# Altium schematic sheet HVP_PowerSupply_v1.0.SchDoc
size A3; Organization: SEW EURODRIVE; Address1: Jose Rubim Rd.; Address2: Santos Dumont Rd.; Address3: 205; Address4: Indaiatuba/SP; Address5: Brazil
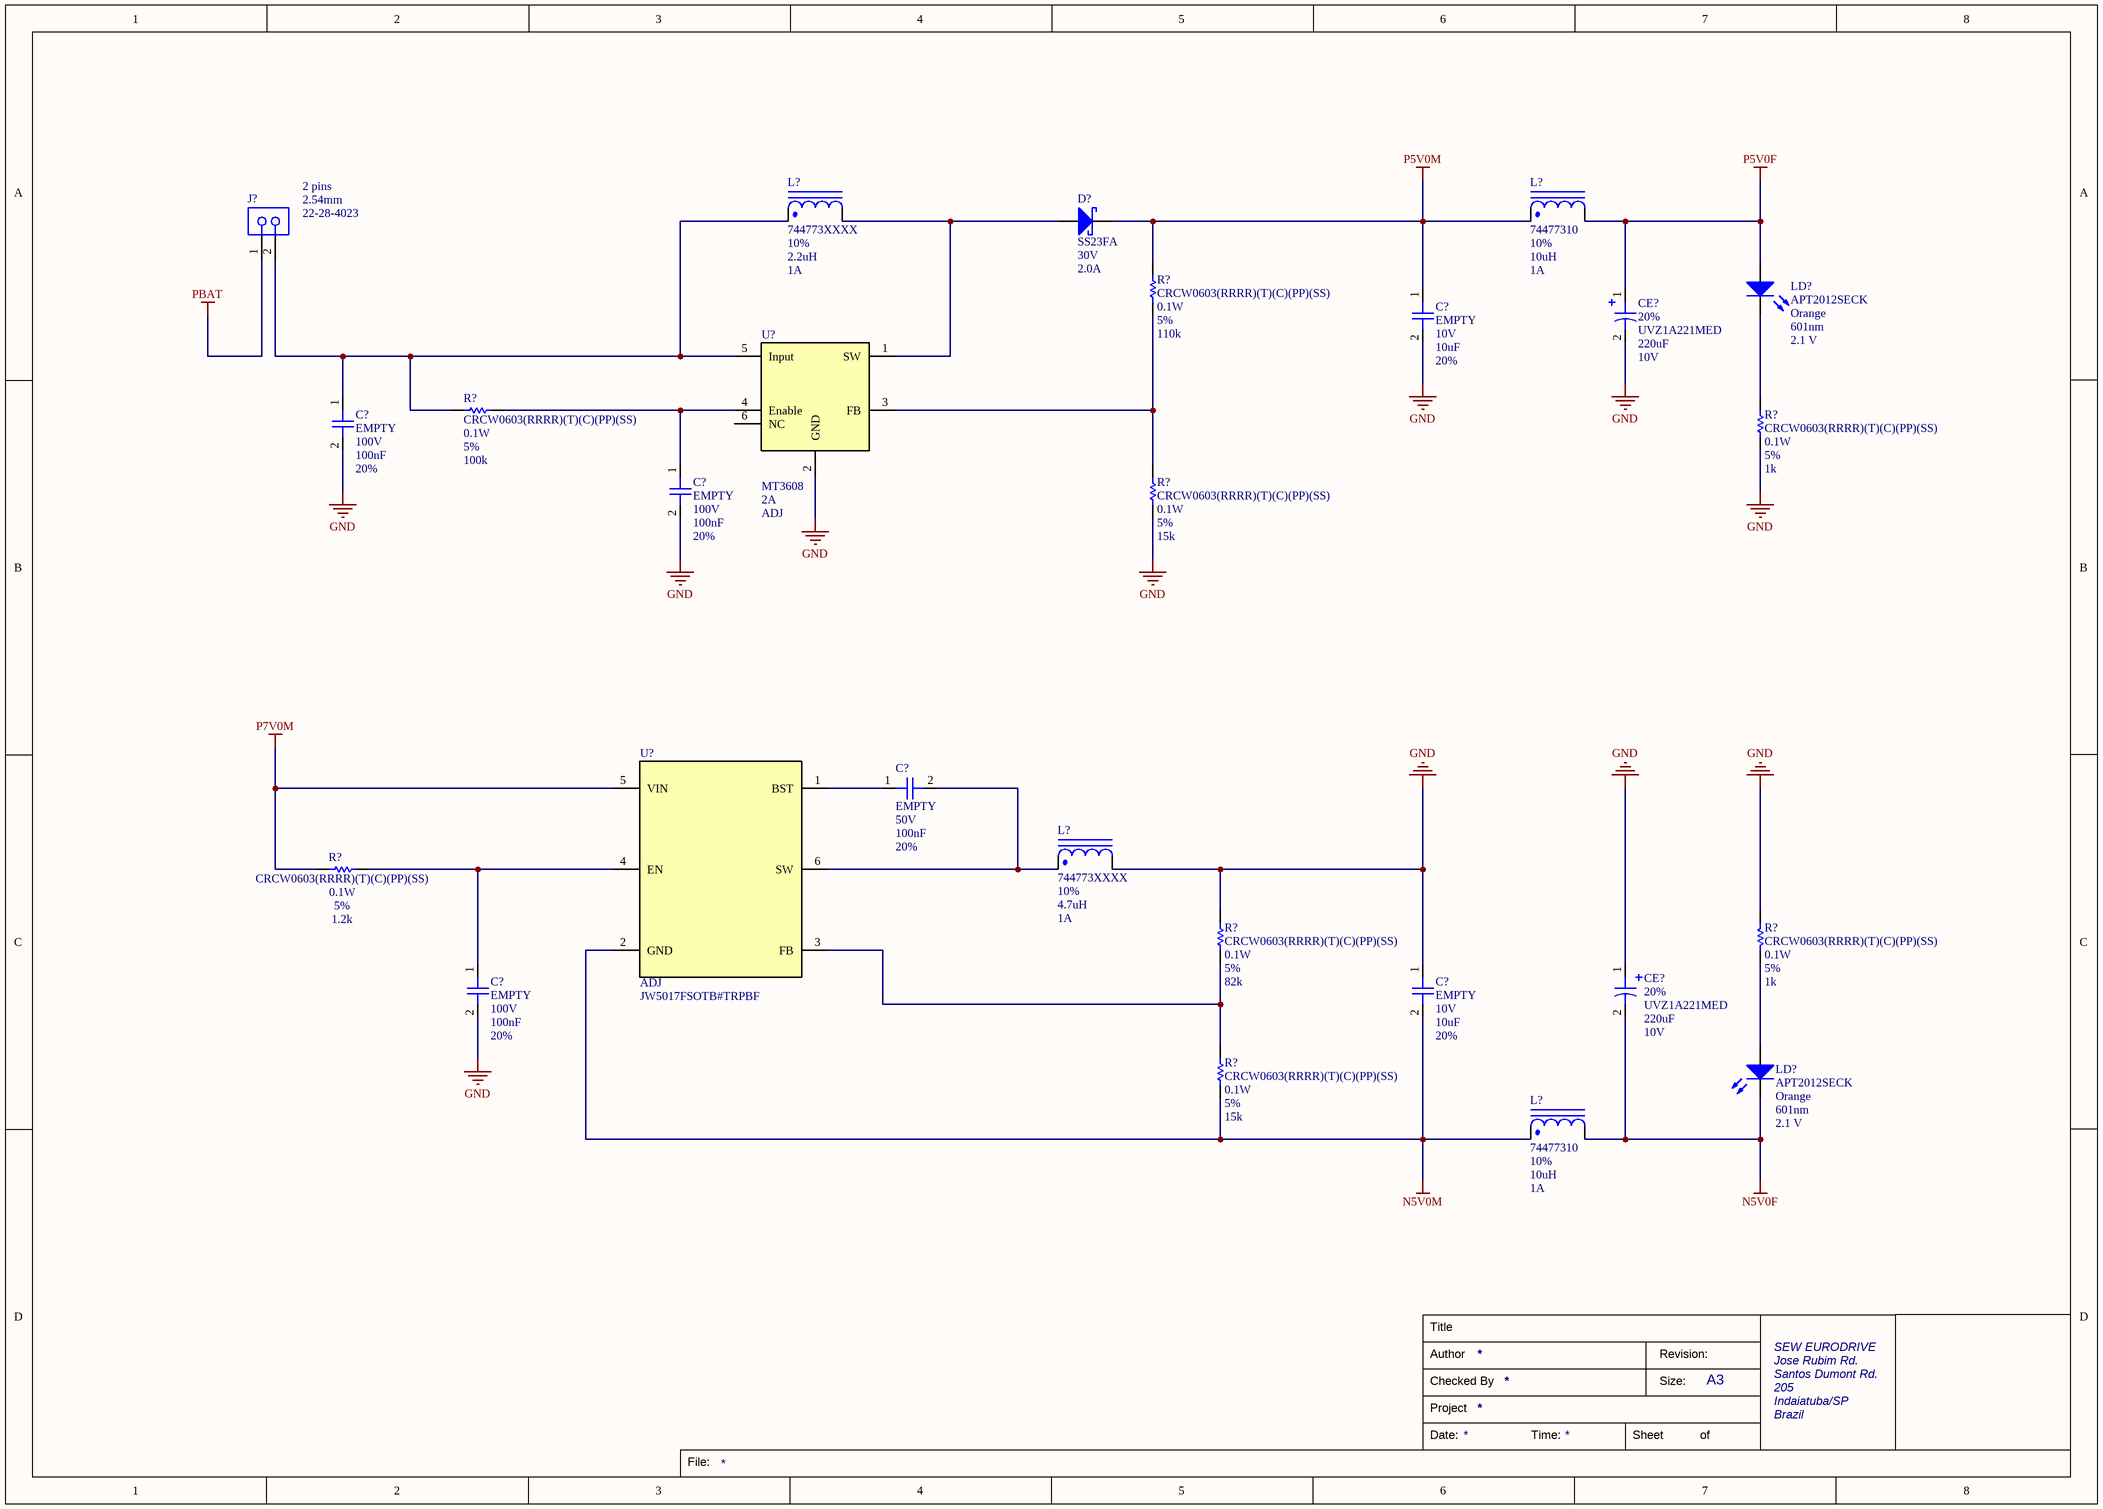
[diagram p0: HVP_PowerSupply_v1.0.SchDoc]

## Parts
(Parts that share a designator on the sheet are numbered #1, #2 ... from top to bottom, then left to right.)
C?#1  value 10uF  PartNumber1: EMPTY  Voltage: 10V  Tolerance: 20%  [CAP0805]  (hidden comment: CC0805)
C?#2  value 100nF  PartNumber1: EMPTY  Voltage: 100V  Tolerance: 20%  [CAP0603]  (hidden comment: CC0603)
C?#3  value 100nF  PartNumber1: EMPTY  Voltage: 100V  Tolerance: 20%  [CAP0603]  (hidden comment: CC0603)
C?#4  value 100nF  PartNumber1: EMPTY  Voltage: 50V  Tolerance: 20%  [CAP0603]  (hidden comment: CC0603)
C?#5  value 100nF  PartNumber1: EMPTY  Voltage: 100V  Tolerance: 20%  [CAP0603]  (hidden comment: CC0603)
C?#6  value 10uF  PartNumber1: EMPTY  Voltage: 10V  Tolerance: 20%  [CAP0805]  (hidden comment: CC0805)
CE?#1  value 220uF  Tolerance: 20%  PartNumber1: UVZ1A221MED  Voltage: 10V  [2.5-6.3-11.0]  (hidden comment: 10V 220uF)
CE?#2  value 220uF  Tolerance: 20%  PartNumber1: UVZ1A221MED  Voltage: 10V  [2.5-6.3-11.0]  (hidden comment: 10V 220uF)
D?  Vrrm: 30V  If: 2.0A  [SOD-123FA]  (hidden comment: SS23FA)
J?  Pins: 2 pins  Pitch: 2.54mm  [CONSIL02STRMALE_100_100]  (hidden comment: 22-28-4023)
L?#1  value 2.2uH  PartNumber1: 744773XXXX  Tolerance: 10%  Current: 1A  [WE-PD2-4532]  (hidden comment: WE-PD2 4532)
L?#2  value 10uH  PartNumber1: 74477310  Tolerance: 10%  Current: 1A  [WE-PD2-4532]  (hidden comment: WE-PD2 4532)
L?#3  value 4.7uH  PartNumber1: 744773XXXX  Tolerance: 10%  Current: 1A  [WE-PD2-4532]  (hidden comment: WE-PD2 4532)
L?#4  value 10uH  PartNumber1: 74477310  Tolerance: 10%  Current: 1A  [WE-PD2-4532]  (hidden comment: WE-PD2 4532)
LD?#1  Colour: Orange  Wavelength: 601nm  Vled: 2.1 V  [LED0805]  (hidden comment: APT2012SECK)
LD?#2  Colour: Orange  Wavelength: 601nm  Vled: 2.1 V  [LED0805]  (hidden comment: APT2012SECK)
R?#1  value 110k  PartNumber1: CRCW0603(RRRR)(T)(C)(PP)(SS)  Power: 0.1W  Tolerance: 5%  [RES0603]  (hidden comment: Chip Resistor)
R?#2  value 100k  PartNumber1: CRCW0603(RRRR)(T)(C)(PP)(SS)  Power: 0.1W  Tolerance: 5%  [RES0603]  (hidden comment: Chip Resistor)
R?#3  value 1k  PartNumber1: CRCW0603(RRRR)(T)(C)(PP)(SS)  Power: 0.1W  Tolerance: 5%  [RES0603]  (hidden comment: Chip Resistor)
R?#4  value 15k  PartNumber1: CRCW0603(RRRR)(T)(C)(PP)(SS)  Power: 0.1W  Tolerance: 5%  [RES0603]  (hidden comment: Chip Resistor)
R?#5  value 1.2k  PartNumber1: CRCW0603(RRRR)(T)(C)(PP)(SS)  Power: 0.1W  Tolerance: 5%  [RES0603]  (hidden comment: Chip Resistor)
R?#6  value 82k  PartNumber1: CRCW0603(RRRR)(T)(C)(PP)(SS)  Power: 0.1W  Tolerance: 5%  [RES0603]  (hidden comment: Chip Resistor)
R?#7  value 1k  PartNumber1: CRCW0603(RRRR)(T)(C)(PP)(SS)  Power: 0.1W  Tolerance: 5%  [RES0603]  (hidden comment: Chip Resistor)
R?#8  value 15k  PartNumber1: CRCW0603(RRRR)(T)(C)(PP)(SS)  Power: 0.1W  Tolerance: 5%  [RES0603]  (hidden comment: Chip Resistor)
U?#1  Current: 2A  Voltage: ADJ  [SOT23-6]  (hidden comment: MT3608)
U?#2  Voltage: ADJ  PartNumber1: JW5017FSOTB#TRPBF  [SOT23-6]  (hidden comment: JW5017F)

## Nets
GND: C?#1.2 C?#2.2 C?#3.2 C?#5.2 C?#6.1 CE?#1.2 CE?#2.1 L?#3.2 R?#3.2 R?#4.1 R?#6.2 R?#7.2 U?#1.2(GND)
N5V0F: CE?#2.2 L?#4.2 LD?#2.K
N5V0M: C?#6.2 L?#4.1 R?#8.1 U?#2.2(GND)
P5V0F: CE?#1.1 L?#2.2 LD?#1.A
P5V0M: C?#1.1 D?.K L?#2.1 R?#1.2
P7V0M: R?#5.2 U?#2.5(VIN)
PBAT: J?.1
NetC?#2_1: C?#2.1 J?.2 L?#1.1 R?#2.2 U?#1.5(Input)
NetC?#3_1: C?#3.1 R?#2.1 U?#1.4(Enable)
NetC?#4_1: C?#4.1 U?#2.1(BST)
NetC?#4_2: C?#4.2 L?#3.1 U?#2.6(SW)
NetC?#5_1: C?#5.1 R?#5.1 U?#2.4(EN)
NetD?_A: D?.A L?#1.2 U?#1.1(SW)
NetLD?#1_K: LD?#1.K R?#3.1
NetLD?#2_A: LD?#2.A R?#7.1
NetR?#1_1: R?#1.1 R?#4.2 U?#1.3(FB)
NetR?#6_1: R?#6.1 R?#8.2 U?#2.3(FB)

Not connected (* = marked no-connect by the designer): U?#1 6(NC)

## Notes on the sheet
- Title
- Author
- Checked By
- Size:
- Revision:
- A3
- Date:
- Project
- Time:
- Sheet
- of
- File:

## Library data of the parts
C?#1 C?#6 = CC0805: Surface Mount Multilayer Ceramic Chip Capacitors  for Commercial Applications; Manufacter1: Yageo; Published: 19-Jun-2016; LatestRevisionDate: 19-Jun-2016; Publisher: Lucas Moraes; PackageReference: CAP0805; PackageDescription: CAP0805;2 Leads
C?#2-C?#5 = CC0603: Surface Mount Multilayer Ceramic Chip Capacitors  for Commercial Applications; Manufacter1: Yageo; Published: 19-Jun-2016; LatestRevisionDate: 19-Jun-2016; Publisher: Lucas Moraes; PackageReference: CAP0603; PackageDescription: CAP0603;2 Leads
CE?#1 CE?#2 = 10V 220uF: Electrolytic Capacitor PTH; Manufacter1: Nichicon; Code: 221; Published: 26-Dec-2016; LatestRevisionDate: 26-Dec-2016; PackageReference: 2.5-6.3; Publisher: Lucas Moraes; PackageDescription: 2.5-6.3;2 leads; LatestRevisionNote: Created
D? = SS23FA: HIGH EFFICIENCY FAST RECOVERY RECTIFIER DIODE; Manufacter1: Fairchild; Vf: 0.50V; Published: 29-Jun-2016; LatestRevisionDate: 29-Jun-2016; PackageReference: SOD-123FA; Publisher: Lucas Moraes; PackageDescription: SOD-123FA; 2 Leads; PartNumber1: SS23FA
J? = 22-28-4023: Headers & Wire Housings 02 MODII HDR SRST B/A .100CL; Manufacter1: Molex; LastRevisionNote: Created; Gender: Male; Published: 15-Set-2017; LatestRevisionDate: 27-Mar-2023; PackageReference: CONSIL02STRMALE_100_100; Publisher: Lucas Moraes; PackageDescription: CONSIL02STRMALE_100_100; 2 Leads; Type: Pin; PartNumber1: 22-28-4023
L?#1-L?#4 = WE-PD2 4532: Fixed Inductors WE-PD2 4532; Manufacter1: Wurth Elektronik; LatestRevisionDate: 22-Mar-2022; PackageReference: WE-PD2 4532; Publisher: Lucas Moraes; PackageDescription: WE-PD2 4532; 2 Leads; Published: 22-Mar-2022; Datasheet: https://www.we-online.com/catalog/en/WE-PD2
LD?#1 LD?#2 = APT2012SECK: Standard LEDs - SMD 0805 Orange; Manufacter1: Kingbright; LastRevisionNote: Created; Published: 29-Dec-2016; PackageReference: LED0805; Publisher: Lucas Moraes; PackageDescription: LED0805; 2 leads; LastRevision: 29-Dec-2016; Datasheet: http://www.mouser.com/ds/2/216/APT2012SECK-230997.pdf; PartNumber1: APT2012SECK
R?#1-R?#8 = CRCW0603: Thick Film Chip Resistors with CECC Approval,  available with Established Reliability; Manufacter1: Vishay; LatestRevisionDate: 06-May-2016; PackageReference: 0603; Publisher: Lucas Moraes; PackageDescription: SMD 0603; 2 Leads; Published: 06-May-2016
U?#1 = MT3608: High Efficiency 1.2MHz 2A Step Up Converter; Manufacter1: AEROSEMI; Published: 22-Dec-2019; LatestRevisionDate: 22-Dec-2019; LatestRevisionNote: Created; PackageReference: SOT-23-6; Publisher: Lucas Moraes; PackageDescription: SOT-23-6;6 Leads; PartNumber2: *; Manufacter2: *; Manufacter3: *; PartNumber3: *; PartNumber1: MT3608
U?#2 = JW5017F: 1.2A, 26V Synchronous Step-Down Converter; Manufacter1: JOULWATT; Current: 1.2A; LatestRevisionDate: 08-Jan-2022; LatestRevisionNote: Created; PackageDescription: SOT-23-6;6 Leads; PackageReference: SOT-23-6; Published: 08-Jan-2022; Publisher: Lucas Moraes